# EAGLE design 60W 24V to 12V Flyback (EAGLE 9.6.2)
CHECKED_BY: Matthias Cornelis; MADE_BY: Maxim Yudayev; RELEASE_DATE: Nov 17, 2020; REV: Nov-2020 Rev 0.1; STATUS: Released
Assembly variants: Calculation Method of MI w/ RCD, Calculation Method of MI w/ Clamp

## Sheet 1 of 2: Cover Page
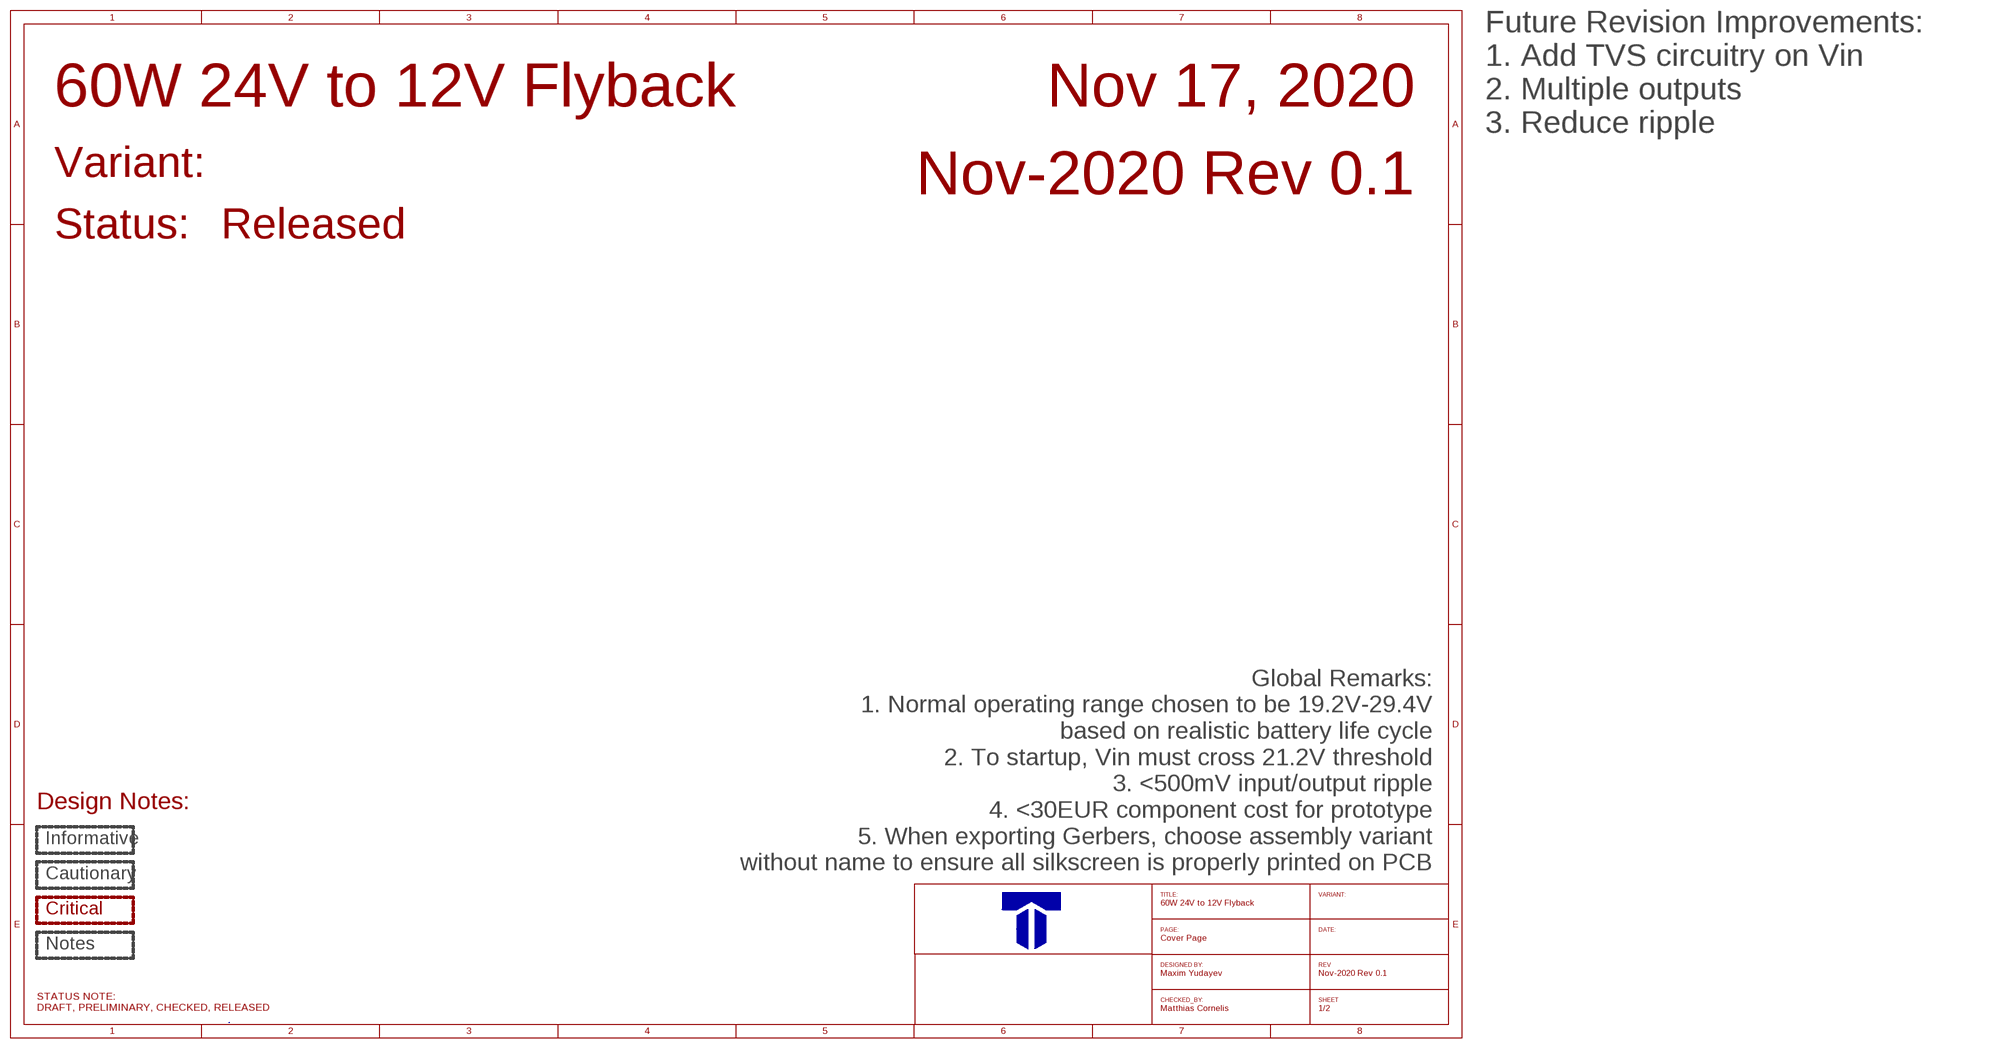
[diagram p0: schematic, sheet 1]

### Notes on the sheet
- Future Revision Improvements:
  1. Add TVS circuitry on Vin
  2. Multiple outputs
  3. Reduce ripple
- Design Notes:
- Informative
- Global Remarks:
  1. Normal operating range chosen to be 19.2V-29.4V
     based on realistic battery life cycle
  2. To startup, Vin must cross 21.2V threshold
  3. <500mV input/output ripple
  4. <30EUR component cost for prototype
  5. When exporting Gerbers, choose assembly variant
     without name to ensure all silkscreen is properly printed on PCB
- Cautionary
- Critical
- Notes

## Sheet 2 of 2: Flyback Converter
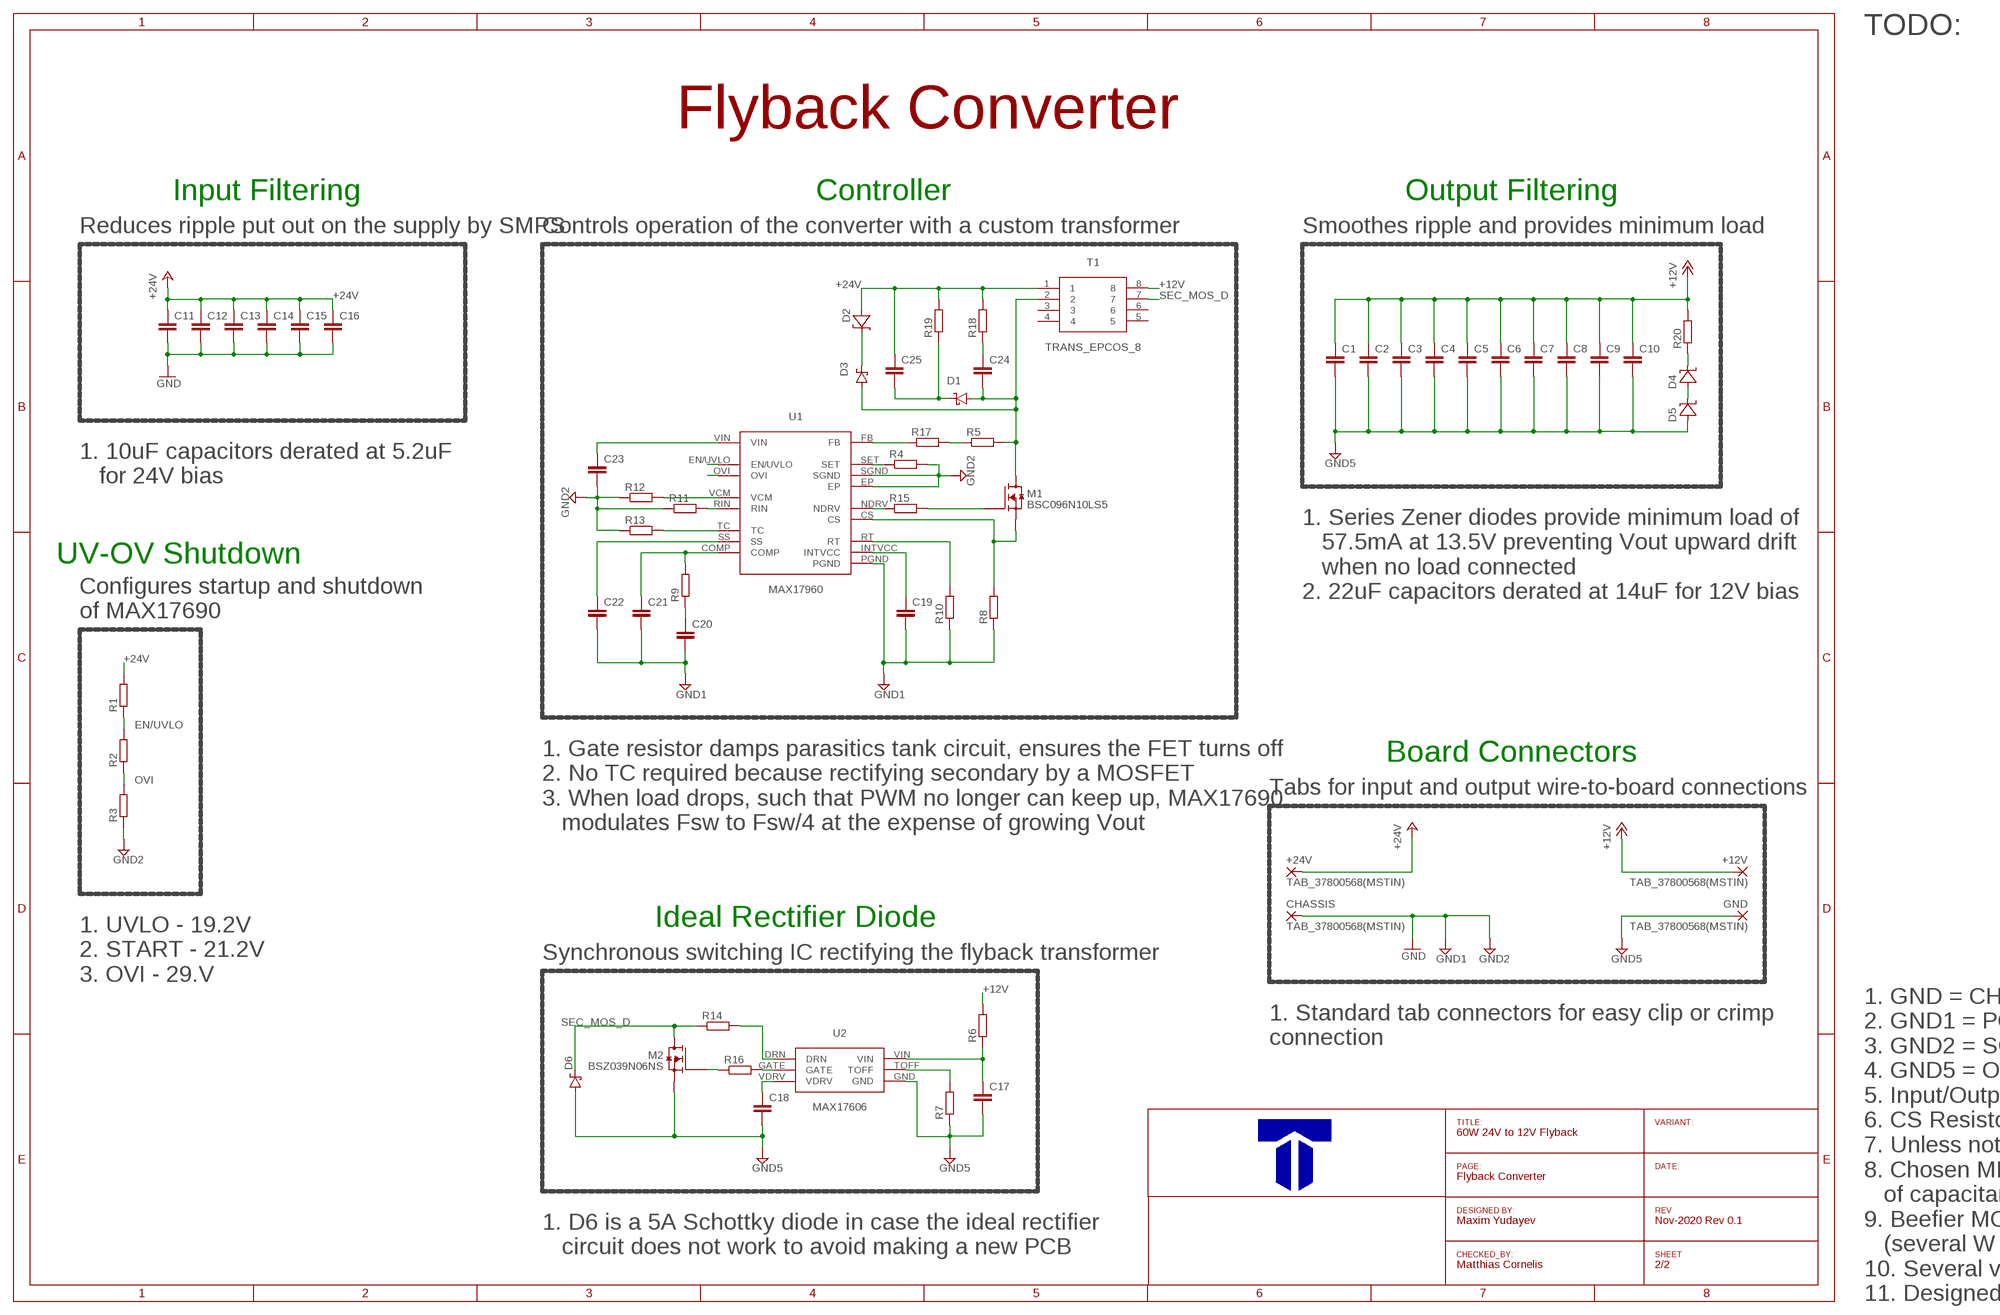
[diagram p1: schematic, sheet 2, part 1 of 2]
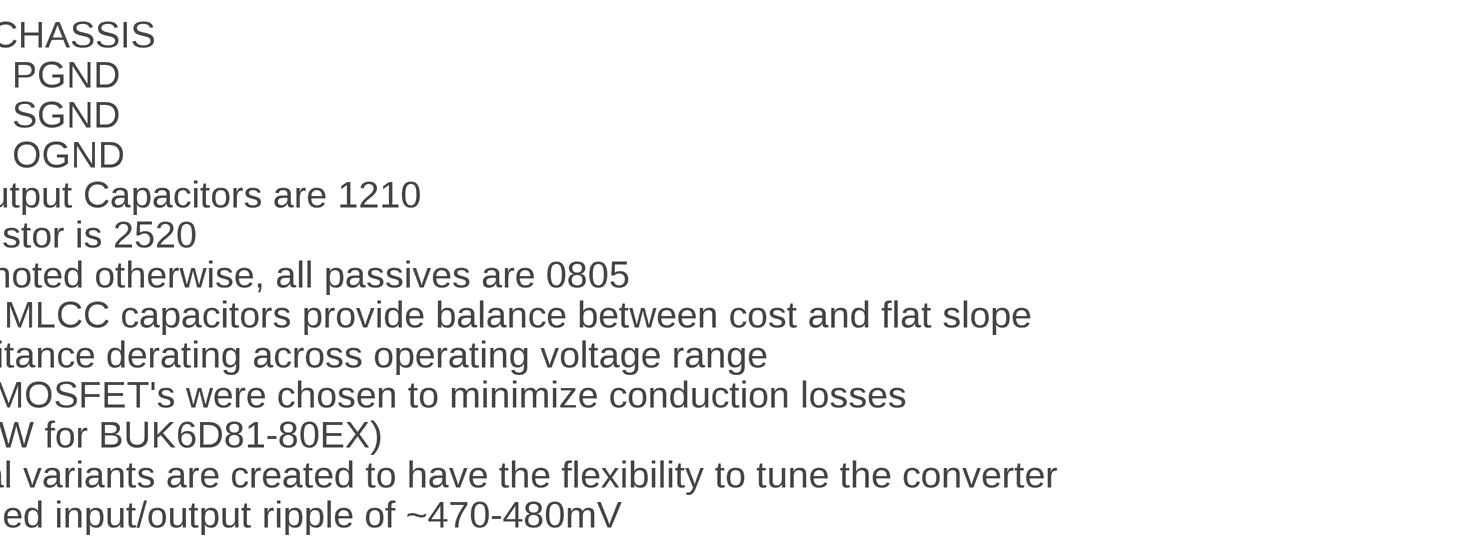
[diagram p2: schematic, sheet 2, part 2 of 2]

### Parts
+12V  TAB_37800568(MSTIN)  [HOLE_1-3]
+24V  TAB_37800568(MSTIN)  [HOLE_1-3]
C1  C-EUC1210K  [C1210K]  (variant Calculation Method of MI w/ RCD: 22u)  (variant Calculation Method of MI w/ Clamp: 22u)
C2  C-EUC1210K  [C1210K]  (variant Calculation Method of MI w/ RCD: 22u)  (variant Calculation Method of MI w/ Clamp: 22u)
C3  C-EUC1210K  [C1210K]  (variant Calculation Method of MI w/ RCD: 22u)  (variant Calculation Method of MI w/ Clamp: 22u)
C4  C-EUC1210K  [C1210K]  (variant Calculation Method of MI w/ RCD: 22u)  (variant Calculation Method of MI w/ Clamp: 22u)
C5  C-EUC1210K  [C1210K]  (variant Calculation Method of MI w/ RCD: 22u)  (variant Calculation Method of MI w/ Clamp: 22u)
C6  C-EUC1210K  [C1210K]  (variant Calculation Method of MI w/ RCD: 22u)  (variant Calculation Method of MI w/ Clamp: 22u)
C7  C-EUC1210K  [C1210K]  (variant Calculation Method of MI w/ RCD: 22u)  (variant Calculation Method of MI w/ Clamp: 22u)
C8  C-EUC1210K  [C1210K]  (variant Calculation Method of MI w/ RCD: 22u)  (variant Calculation Method of MI w/ Clamp: 22u)
C9  C-EUC1210K  [C1210K]  (variant Calculation Method of MI w/ RCD: 22u)  (variant Calculation Method of MI w/ Clamp: 22u)
C10  C-EUC1210K  [C1210K]  (variant Calculation Method of MI w/ RCD: 22u)  (variant Calculation Method of MI w/ Clamp: 22u)
C11  C-EUC1210K  [C1210K]  (variant Calculation Method of MI w/ RCD: 10u)  (variant Calculation Method of MI w/ Clamp: 10u)
C12  C-EUC1210K  [C1210K]  (variant Calculation Method of MI w/ RCD: 10u)  (variant Calculation Method of MI w/ Clamp: 10u)
C13  C-EUC1210K  [C1210K]  (variant Calculation Method of MI w/ RCD: 10u)  (variant Calculation Method of MI w/ Clamp: 10u)
C14  C-EUC1210K  [C1210K]  (variant Calculation Method of MI w/ RCD: 10u)  (variant Calculation Method of MI w/ Clamp: 10u)
C15  C-EUC1210K  [C1210K]  (variant Calculation Method of MI w/ RCD: 10u)  (variant Calculation Method of MI w/ Clamp: 10u)
C16  C-EUC1210K  [C1210K]  (variant Calculation Method of MI w/ RCD: 10u)  (variant Calculation Method of MI w/ Clamp: 10u)
C17  C-EUC0805K  [C0805K]  (variant Calculation Method of MI w/ RCD: 4u7)  (variant Calculation Method of MI w/ Clamp: 4u7)
C18  C-EUC0805K  [C0805K]  (variant Calculation Method of MI w/ RCD: 4u7)  (variant Calculation Method of MI w/ Clamp: 4u7)
C19  C-EUC0805K  [C0805K]  (variant Calculation Method of MI w/ RCD: 4u7)  (variant Calculation Method of MI w/ Clamp: 4u7)
C20  C-EUC0805K  [C0805K]  (variant Calculation Method of MI w/ RCD: 47n)  (variant Calculation Method of MI w/ Clamp: 47n)
C21  C-EUC0805K  [C0805K]  (variant Calculation Method of MI w/ RCD: 560p)  (variant Calculation Method of MI w/ Clamp: 560p)
C22  C-EUC0805K  [C0805K]  (variant Calculation Method of MI w/ RCD: 47n)  (variant Calculation Method of MI w/ Clamp: 47n)
C23  C-EUC0805K  [C0805K]  (variant Calculation Method of MI w/ RCD: 4u7)  (variant Calculation Method of MI w/ Clamp: 4u7)
C24  C-EUC0805K  [C0805K]  (variant Calculation Method of MI w/ RCD: 220p)  (variant Calculation Method of MI w/ Clamp: 220p)
C25  C-EUC0805K  [C0805K]  (not fitted in variant Calculation Method of MI w/ Clamp)  (variant Calculation Method of MI w/ RCD: 150n)
CHASSIS  TAB_37800568(MSTIN)  [HOLE_1-3]
D1  DFLS2100-7  [DFLS2100_DS31475]  (not fitted in variant Calculation Method of MI w/ Clamp)
D2  MMSZ5270BT1G  [MMSZ?T1G_SOD-123_425-04]  (not fitted in variant Calculation Method of MI w/ RCD)
D3  DFLS2100-7  [DFLS2100_DS31475]  (not fitted in variant Calculation Method of MI w/ RCD)
D4  MMSZ4692T1G  [MMSZ?T1G_SOD-123_425-04]
D5  MMSZ4692T1G  [MMSZ?T1G_SOD-123_425-04]
D6  B540C-13-F  [B5?0C-13-F_DO-214AB_DS13012]  (not fitted in variant Calculation Method of MI w/ RCD)  (not fitted in variant Calculation Method of MI w/ Clamp)
GND  TAB_37800568(MSTIN)  [HOLE_1-3]
M1  BSC096N10LS5  [BSC096N10LS5_TDSON-8]
M2  BSZ039N06NS  [BSZ039N06NS_TSDSON-8_Z8B00158553]
R1  R-EU_R0805  [R0805]  (variant Calculation Method of MI w/ RCD: 228k)  (variant Calculation Method of MI w/ Clamp: 228k)
R2  R-EU_R0805  [R0805]  (variant Calculation Method of MI w/ RCD: 3k83)  (variant Calculation Method of MI w/ Clamp: 3k83)
R3  R-EU_R0805  [R0805]  (variant Calculation Method of MI w/ RCD: 10k)  (variant Calculation Method of MI w/ Clamp: 10k)
R4  R-EU_R0805  [R0805]  (variant Calculation Method of MI w/ RCD: 10k)  (variant Calculation Method of MI w/ Clamp: 10k)
R5  R-EU_R0805  [R0805]  (variant Calculation Method of MI w/ RCD: 6k49)  (variant Calculation Method of MI w/ Clamp: 6k49)
R6  R-EU_R0805  [R0805]  (variant Calculation Method of MI w/ RCD: 22)  (variant Calculation Method of MI w/ Clamp: 22)
R7  R-EU_R0805  [R0805]  (variant Calculation Method of MI w/ RCD: 147k)  (variant Calculation Method of MI w/ Clamp: 147k)
R8  R-EU_R2512  [R2512]  (variant Calculation Method of MI w/ RCD: 5m)  (variant Calculation Method of MI w/ Clamp: 5m)
R9  R-EU_R0805  [R0805]  (variant Calculation Method of MI w/ RCD: 3k6)  (variant Calculation Method of MI w/ Clamp: 3k6)
R10  R-EU_R0805  [R0805]  (variant Calculation Method of MI w/ RCD: 33k2)  (variant Calculation Method of MI w/ Clamp: 33k2)
R11  R-EU_R0805  [R0805]  (variant Calculation Method of MI w/ RCD: 137k)  (variant Calculation Method of MI w/ Clamp: 137k)
R12  R-EU_R0805  [R0805]  (variant Calculation Method of MI w/ RCD: 124k)  (variant Calculation Method of MI w/ Clamp: 124k)
R13  R-EU_R0805  [R0805]  (not fitted in variant Calculation Method of MI w/ RCD)  (not fitted in variant Calculation Method of MI w/ Clamp)
R14  R-EU_R0805  [R0805]  (variant Calculation Method of MI w/ RCD: 357)  (variant Calculation Method of MI w/ Clamp: 357)
R15  R-EU_R0805  [R0805]  (variant Calculation Method of MI w/ RCD: 1R2)  (variant Calculation Method of MI w/ Clamp: 1R2)
R16  R-EU_R0805  [R0805]  (variant Calculation Method of MI w/ RCD: 1R2)  (variant Calculation Method of MI w/ Clamp: 1R2)
R17  R-EU_R0805  [R0805]  (variant Calculation Method of MI w/ RCD: 220k)  (variant Calculation Method of MI w/ Clamp: 220k)
R18  R-EU_R0805  [R0805]  (variant Calculation Method of MI w/ RCD: 47)  (variant Calculation Method of MI w/ Clamp: 47)
R19  R-EU_R0805  [R0805]  (not fitted in variant Calculation Method of MI w/ Clamp)  (variant Calculation Method of MI w/ RCD: 10k2)
R20  R-EU_R0805  [R0805]  (variant Calculation Method of MI w/ RCD: 5R1)  (variant Calculation Method of MI w/ Clamp: 5R1)
T1  TRANS_EPCOS_8  [TRANS_EPCOS-B66307_E16/8/5_0.5_3.45UH_200K]
U1  MAX17960  [T1633-4]
U2  MAX17606  [MAX17606_90-0242]

### Nets
+12V: +12V.P$1(P) C1.1 C2.1 C3.1 C4.1 C5.1 C6.1 C7.1 C8.1 C9.1 C10.1 R6.2 R20.2 T1.8
+24V: +24V.P$1(P) C11.1 C12.1 C13.1 C14.1 C15.1 C16.1 C23.1 C25.1 D2.A R1.2 R18.2 R19.2 T1.1 U1.VIN
EN/UVLO: R1.1 R2.2 U1.EN/UVLO
GND: C11.2 C12.2 C13.2 C14.2 C15.2 C16.2 C19.2 C20.2 C21.2 C22.2 C23.2 CHASSIS.P$1(P) R3.1 R4.2 R8.1 R10.1 R11.1 R12.1 R13.1 U1.EP U1.PGND U1.SGND ; supply symbol labelled GND1, GND2
GND5: C1.2 C2.2 C3.2 C4.2 C5.2 C6.2 C7.2 C8.2 C9.2 C10.2 C17.2 C18.2 D5.A D6.A GND.P$1(P) M2.S R7.1 U2.GND
N$1: R4.1 U1.SET
N$2: C18.1 U2.VDRV
N$3: R17.1 U1.FB
N$4: C24.1 R18.1
N$5: C17.1 R6.1 U2.VIN
N$6: R7.2 U2.TOFF
N$7: R14.2 U2.DRN
N$8: C19.1 U1.INTVCC
N$9: C25.2 D1.C(K) R19.1
N$10: C20.1 R9.1
N$11: C21.1 R9.2 U1.COMP
N$12: R10.2 U1.RT
N$13: C22.1 U1.SS
N$14: R12.2 U1.VCM
N$15: R11.2 U1.RIN
N$16: R13.2 U1.TC
N$17: R15.1 U1.NDRV
N$18: R16.2 U2.GATE
N$19: R5.1 R17.2
N$20: D2.C D3.C(K)
N$21: D4.C R20.1
N$22: D4.A D5.C
OVI: R2.1 R3.2 U1.OVI
PRI_MOS_D: C24.2 D1.A D3.A M1.D R5.2 T1.2
PRI_MOS_G: M1.G R15.2
PRI_MOS_S: M1.S R8.2 U1.CS
SEC_MOS_D: D6.C(K) M2.D R14.1 T1.7
SEC_MOS_G: M2.G R16.1
Unconnected: T1.3 T1.4 T1.5 T1.6

### Notes on the sheet
- TODO:
- Input Filtering | Controller | Output Filtering
- Reduces ripple put out on the supply by SMPS | Controls operation of the converter with a custom transformer | Smoothes ripple and provides minimum load
- 1. 10uF capacitors derated at 5.2uF 
     for 24V bias
- 1. Series Zener diodes provide minimum load of
     57.5mA at 13.5V preventing Vout upward drift
     when no load connected
  2. 22uF capacitors derated at 14uF for 12V bias
- UV-OV Shutdown
- Configures startup and shutdown
  of MAX17690
- 1. Gate resistor damps parasitics tank circuit, ensures the FET turns off
  2. No TC required because rectifying secondary by a MOSFET
  3. When load drops, such that PWM no longer can keep up, MAX17690
     modulates Fsw to Fsw/4 at the expense of growing Vout
- Board Connectors
- Tabs for input and output wire-to-board connections
- 1. UVLO - 19.2V
  2. START - 21.2V
  3. OVI - 29.V
- Ideal Rectifier Diode
- Synchronous switching IC rectifying the flyback transformer
- 1. Standard tab connectors for easy clip or crimp
  connection
- 1. D6 is a 5A Schottky diode in case the ideal rectifier
     circuit does not work to avoid making a new PCB
- 1. GND = CHASSIS
  2. GND1 = PGND
  3. GND2 = SGND
  4. GND5 = OGND
  5. Input/Output Capacitors are 1210
  6. CS Resistor is 2520
  7. Unless noted otherwise, all passives are 0805
  8. Chosen MLCC capacitors provide balance between cost and flat slope
     of capacitance derating across operating voltage range
  9. Beefier MOSFET's were chosen to minimize conduction losses
     (several W for BUK6D81-80EX)
  10. Several variants are created to have the flexibility to tune the converter
  11. Designed input/output ripple of ~470-480mV

## Library data of the parts
+12V +24V CHASSIS GND = Maxim's KU Leuven:TAB_37800568(MSTIN)
C1-C16 = Maxim's KU Leuven:C-EU: CAPACITOR, European symbol
C17-C25 = Maxim's KU Leuven:C-EU: CAPACITOR, European symbol; SPICEPREFIX: C
D1 D3 = Maxim's KU Leuven:DFLS2100*
D2 = Maxim's KU Leuven:MMSZ52?T1G
D4 D5 = Maxim's KU Leuven:MMSZ4?T1G
D6 = Maxim's KU Leuven:B5?0C-13-F
M1 = Maxim's KU Leuven:BSC096N10LS5
M2 = Maxim's KU Leuven:BSZ039N06NS
R1-R7 R9-R20 = Maxim's KU Leuven:R-EU_: RESISTOR, European symbol; SPICEPREFIX: R
R8 = Maxim's KU Leuven:R-EU_: RESISTOR, European symbol
T1 = Maxim's KU Leuven:TRANS_EPCOS_8
U1 = Maxim's KU Leuven:MAX17960*
U2 = Maxim's KU Leuven:MAX17606

## Board
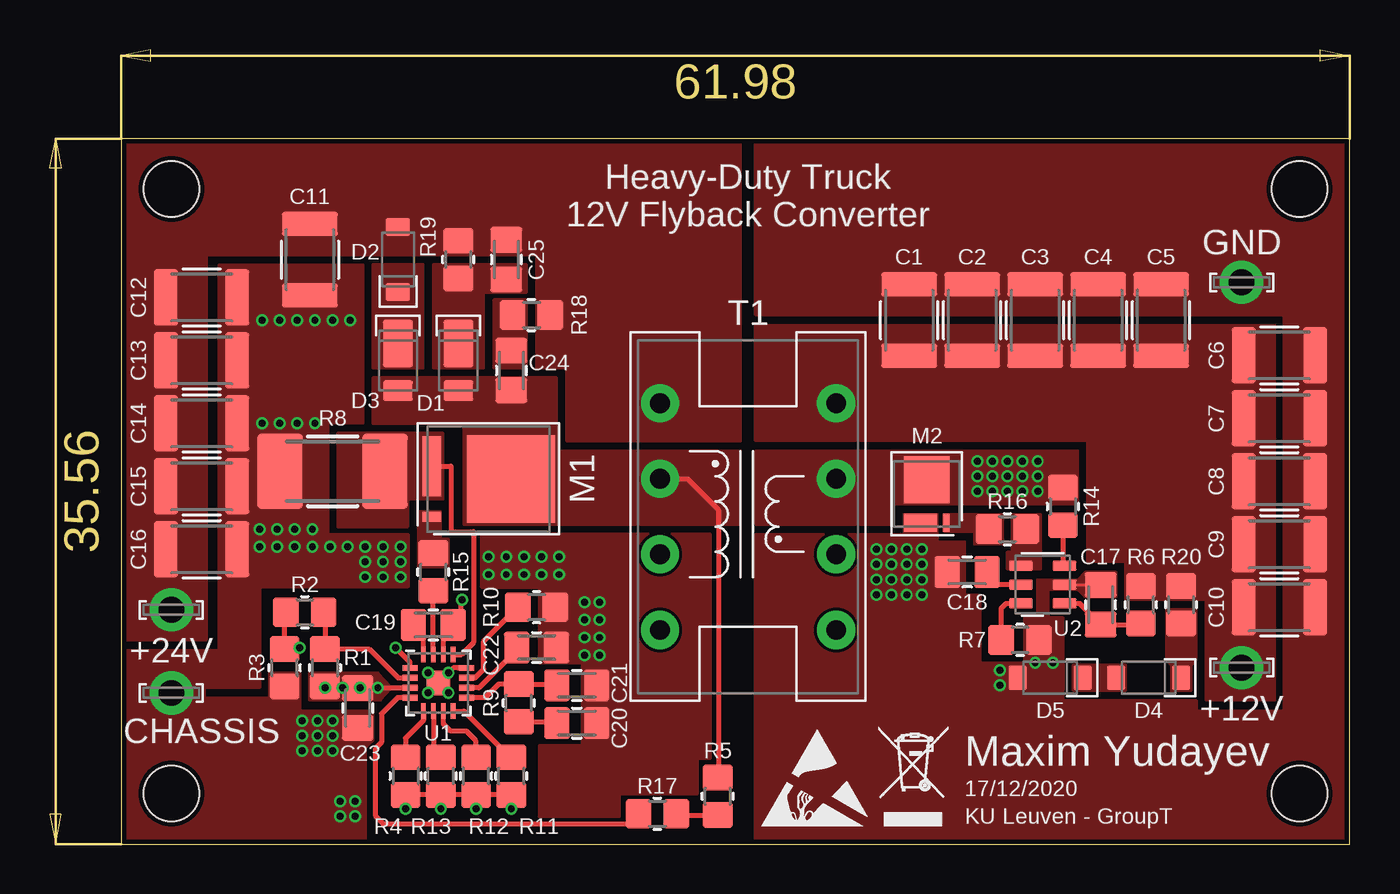
[diagram p3: board, top side]
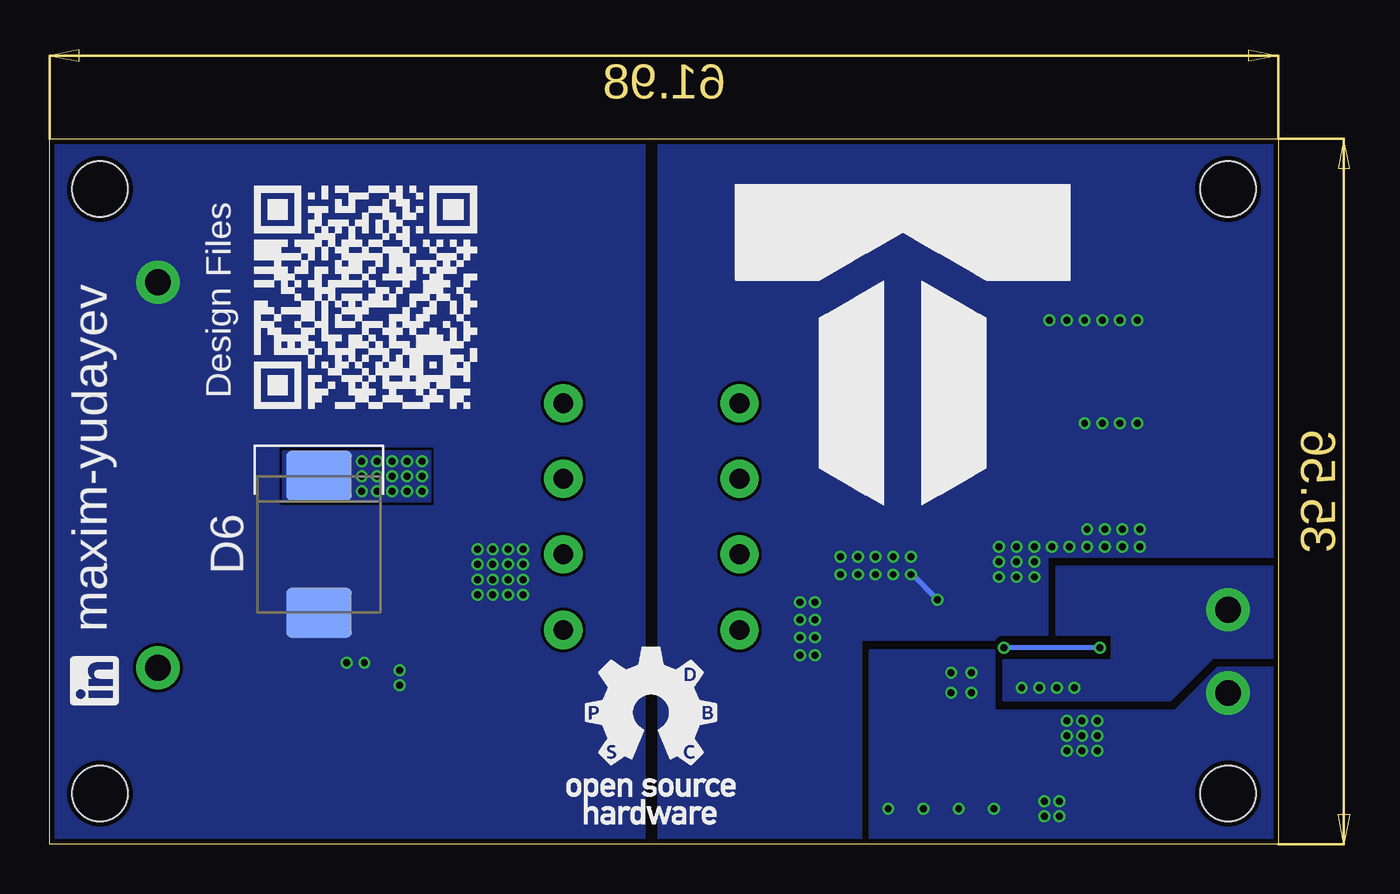
[diagram p4: board, bottom side, seen from below]

Size 61.98 x 35.56 mm. Coordinates in mm from the lower left corner, seen from the top.
Outline: 0,0 61.98,0 61.98,35.56 0,35.56 0,0
Copper layers (1*16): Top 0.018mm / dielectric 1.55mm / Bottom 0.018mm
Design rules "eC_2Layer_PClass6_BaseCopperO18_eCDefault": minimum track width 0.15mm, minimum drill 0.35mm, track to track 0.15mm, track to pad 0.15mm, pad to pad 0.15mm, via to via 0.15mm, smd to smd 0mil, copper to edge 0.25mm, drill to drill 0.35mm, minimum pad ring 0.175mm, minimum via ring 0.125mm, stop-mask expansion 0mil, vias tented up to drill 0.45mm, thermal gap 0.2mm
Holes 2.8 mm at 59.44,33.02 59.44,2.54 2.54,33.02 2.54,2.54
tRestrict: 8 lines

### Footprints (pad centres in the part's own frame; a part is rotated, then mirrored left to right if it is on the bottom)
HOLE_1-3 = drill 1.3 pad 2.184: P$1 0,0
C1210K = smd 1.2 x 2.8: 1 -1.8,0; 2 1.8,0
C0805K = smd 1.3 x 1.6: 1 -1,0; 2 1,0
DFLS2100_DS31475 = smd 1.05 x 1.5: A -1.525,0 | smd 2.4 x 1.5: C 0.85,0
MMSZ?T1G_SOD-123_425-04 = smd 0.91 x 1.22: A -1.635,0; C 1.635,0
B5?0C-13-F_DO-214AB_DS13012 = smd 2.5 x 3.3: A -3.45,0; C 3.45,0
BSC096N10LS5_TDSON-8 = smd 4.41 x 4.455: D 0,1.13 | smd 0.5 x 0.925: G 1.905,-2.865 | smd 3.04 x 0.925: S -0.635,-2.865
BSZ039N06NS_TSDSON-8_Z8B00158553 = smd 2.29 x 2.36: D 0,0.72 | smd 0.34 x 0.9: G 0.975,-1.45 | smd 1.64 x 0.9: S -0.325,-1.45
R0805 = smd 1.3 x 1.5: 1 -0.95,0; 2 0.95,0
R2512 = smd 2.3 x 3.8: 1 -2.65,0; 2 2.65,0
TRANS_EPCOS-B66307_E16/8/5_0.5_3.45UH_200K = drill 1 pad 1.93: 1 -4.445,5.715; 2 -4.445,1.905; 3 -4.445,-1.905; 4 -4.445,-5.715; 5 4.445,-5.715; 6 4.445,-1.905; 7 4.445,1.905; 8 4.445,5.715
T1633-4 = smd 0.8 x 0.3: COMP 1.425,-0.75; EN/UVLO -1.425,0.25; FB -1.425,-0.75; OVI -1.425,0.75; RT 1.425,0.25; SGND 1.425,0.75; SS 1.425,-0.25; VIN -1.425,-0.25 | smd 0.3 x 0.8: CS 0.75,1.425; INTVCC -0.75,1.425; NDRV -0.25,1.425; PGND 0.25,1.425; RIN 0.75,-1.425; SET -0.75,-1.425; TC -0.25,-1.425; VCM 0.25,-1.425 | smd 1.23 x 1.23: EP 0,0
MAX17606_90-0242 = smd 1.2 x 0.5: DRN -1.1,-0.95; GATE 1.1,-0.95; GND -1.1,0; TOFF 1.1,0.95; VDRV 1.1,0; VIN -1.1,0.95

### Placement (x,y rotation side)
+12V  56.52,8.89 90 top
+24V  2.54,11.81 270 top
C1  22u  [C1210K]  39.75,26.42 90 top
C2  22u  [C1210K]  42.93,26.42 90 top
C3  22u  [C1210K]  46.1,26.42 90 top
C4  22u  [C1210K]  49.28,26.42 90 top
C5  22u  [C1210K]  52.45,26.42 90 top
C6  22u  [C1210K]  58.42,24.64 0 top
C7  22u  [C1210K]  58.42,21.46 0 top
C8  22u  [C1210K]  58.42,18.29 0 top
C9  22u  [C1210K]  58.42,15.11 0 top
C10  22u  [C1210K]  58.42,11.94 0 top
C11  10u  [C1210K]  9.53,29.46 270 top
C12  10u  [C1210K]  4.06,27.56 0 top
C13  10u  [C1210K]  4.06,24.38 0 top
C14  10u  [C1210K]  4.06,21.21 0 top
C15  10u  [C1210K]  4.06,18.03 0 top
C16  10u  [C1210K]  4.06,14.86 0 top
C17  4u7  [C0805K]  49.4,12.06 90 top
C18  4u7  [C0805K]  42.67,13.72 180 top
C19  4u7  [C0805K]  15.75,11.05 0 top
C20  47n  [C0805K]  22.99,6.1 0 top
C21  560p  [C0805K]  22.99,8 0 top
C22  47n  [C0805K]  20.95,9.91 0 top
C23  4u7  [C0805K]  11.94,6.86 270 top
C24  220p  [C0805K]  19.68,23.88 270 top
C25  150n  [C0805K]  19.43,29.46 270 top  (not fitted)
CHASSIS  2.54,7.62 270 top
D1  17.02,24.38 90 top  (not fitted)
D2  13.97,29.46 270 top
D3  13.97,24.38 90 top
D4  51.82,8.38 0 top
D5  46.86,8.38 0 top
D6  48.39,15.11 90 bottom  (not fitted)
GND  56.52,28.32 90 top
M1  18.54,18.41 270 top
M2  40.64,17.65 0 top
R1  228k  [R0805]  10.29,8.89 270 top
R2  3k83  [R0805]  9.27,11.68 0 top
R3  10k  [R0805]  8.26,8.89 90 top
R4  10k  [R0805]  14.35,3.43 270 top
R5  6k49  [R0805]  30.1,2.41 90 top
R6  22  [R0805]  51.44,12.06 90 top
R7  147k  [R0805]  45.34,10.29 180 top
R8  5m  [R2512]  10.67,18.8 0 top
R9  3k6  [R0805]  20.07,7.11 90 top
R10  33k2  [R0805]  20.95,11.94 180 top
R11  137k  [R0805]  19.68,3.43 90 top
R12  124k  [R0805]  17.91,3.43 90 top
R13  16.13,3.43 90 top  (not fitted)
R14  357  [R0805]  47.5,17.02 270 top
R15  1R2  [R0805]  15.75,13.72 90 top
R16  1R2  [R0805]  44.7,15.88 0 top
R17  220k  [R0805]  27.05,1.52 0 top
R18  47  [R0805]  20.7,26.67 0 top
R19  10k2  [R0805]  17.02,29.46 90 top  (not fitted)
R20  5R1  [R0805]  53.47,12.06 90 top
T1  31.62,16.51 0 top
U1  16,8.13 0 top
U2  46.48,13.08 180 top

### Tracks (layer width: path | path; a pad name or v marks a point on that pad's centre or on a via)
+12V
  pour Top (no thermals): 32,20.32 32,26.16 58.17,26.16 58.17,7.24 54.74,7.24 54.74,12.32 50.67,12.32 50.67,14.22 48.77,14.22 48.77,20.32
+24V  (via drill 0.35)
  Top 0.254: C23.1 11.96,7.88 U1.VIN
  other vias: 10.29,7.87 11.18,7.87 12.06,7.87 12.95,7.87
  pour Top (no thermals): 0,35.56 0,10.29 4.32,10.29 4.32,29.72 20.95,29.72 20.95,24 22.48,24 22.48,20.32 31.24,20.32 31.24,35.56
  pour Top (no thermals): 9.53,7.24 9.53,8.64 12.94,8.64 13.58,7.95 14.9,7.95 14.9,7.8 13.58,7.8 13.07,7.24
  pour Bottom (no thermals): 11.18,10.54 11.18,13.97 0,13.97 0,9.4 3.3,9.4 5.46,7.24 13.84,7.24 13.84,9.27 8.38,9.27 8.38,10.54
EN/UVLO
  Top 0.254: R2.2 10.29,11.62 R1.1 12.51,9.84 13.97,8.38 U1.EN/UVLO
GND  (via drill 0.35)
  Top 0.254: U1.SGND 17,8.88 16.75,8.88 v16.51,8.64 U1.EP | U1.EP v15.49,7.62 | U1.EP v15.49,8.64 | U1.EP v16.51,7.62 | R12.1 R11.1 v19.68,1.78 | R12.1 R13.1 | R13.1 R4.2 v14.35,1.78 | v17.2,12.32 17.13,12.24 17.13,11.43 C19.2 16.25,10.55 U1.PGND | R13.1 v16.13,1.78 | R12.1 v17.91,1.78
  Bottom 0.254: v18.54,13.59 18.47,13.59 v17.2,12.32
  other vias: 23.37,12.19 24.13,12.19 23.37,11.3 24.13,10.41 24.13,11.3 23.37,10.41 23.37,9.53 24.13,9.53 19.43,13.59 19.43,14.48 20.32,13.59 21.21,14.48 20.32,14.48 21.21,13.59 22.1,13.59 22.1,14.48 9.14,4.7 10.67,5.46 9.91,6.22 9.14,6.22 10.67,4.7 10.67,6.22 9.91,4.7 9.91,5.46 9.14,5.46 6.99,14.99 7.87,14.99 10.54,14.99 7.87,15.88 11.43,14.99 6.99,15.88 7.11,21.21 8,21.21 8.76,14.99 9.65,14.99 12.32,14.99 9.65,15.88 13.21,14.99 8.76,15.88 8.89,21.21 9.78,21.21 18.54,14.48 7.11,26.42 8,26.42 8.89,26.42 9.78,26.42 10.67,26.42 11.56,26.42 14.1,14.99 12.32,14.22 13.21,14.22 14.1,14.22 12.32,13.46 13.21,13.46 14.1,13.46 11.81,2.16 11.81,1.4 11.05,1.4 11.05,2.16
  pour Top (no thermals): 6.99,7.87 4.19,7.87 4.19,6.99 0,6.99 0,9.78 4.95,9.78 4.95,29.21 12.19,29.21 12.19,21.21 10.41,21.21 10.41,15.62 14.48,15.62 14.48,12.95 6.99,12.95
  pour Bottom (no thermals): 11.68,14.48 11.68,10.54 14.1,10.54 14.35,10.29 21.08,10.29 21.08,0 31.24,0 31.24,35.56 0,35.56 0,14.48
  pour Top (no thermals): 21.08,9.14 23.24,9.14 23.24,4.95 21.08,4.95 21.08,1.4 25.15,1.4 25.15,2.54 29.08,2.54 29.08,4.32 29.72,4.32 29.72,15.62 18.16,15.62 18.16,12.95 21.08,12.95
  pour Top (no thermals): 0,7.37 7.49,7.37 7.49,8.64 9.02,8.64 9.02,6.73 12.7,6.73 12.7,5.21 12.32,4.83 12.32,0 0,0
  pour Bottom (no thermals): 20.57,0 20.57,9.78 14.35,9.78 14.35,6.73 5.21,6.73 3.05,8.89 0,8.89 0,0
GND5  (via drill 0.35)
  Top 0.152: U2.GND 49.39,13.08 C17.2
  other vias: 38.1,14.86 38.1,14.1 38.1,13.34 38.86,13.34 38.86,14.1 38.86,14.86 39.62,14.86 39.62,14.1 39.62,13.34 44.32,8.76 44.32,8 46.1,9.14 46.99,9.14 40.39,14.86 40.39,13.34 40.39,14.1 38.1,12.57 38.86,12.57 39.62,12.57 40.39,12.57
  pour Top (no thermals): 39.5,16.64 41.15,16.64 41.15,15.24 42.55,15.24 42.55,12.57 43.31,12.57 43.31,9.14 45.59,9.14 45.59,11.43 46.23,11.43 46.23,13.34 48.26,13.34 48.64,13.72 50.16,13.72 50.16,12.45 48.64,12.45 48.26,12.83 46.74,12.83 46.74,11.43 47.5,11.43 47.5,7.24 54.23,7.24 54.23,6.73 58.67,6.73 58.67,26.67 32,26.67 32,35.56 61.98,35.56 61.98,0 32,0 32,15.62 39.5,15.62
  pour Bottom (rank 2, no thermals): 32,35.56 32,0 61.98,0 61.98,35.56
N$1
  Top 0.254: U1.SET 15.25,6.24 14.35,5.33 R4.1
N$2
  Top 0.254: U2.VDRV 44.18,13.08 43.67,13.59 C18.1
N$3
  Top 0.254: U1.FB 13.94,7.38 13.14,6.58 13.14,5.12 12.82,4.79 12.82,1.43 13.23,1.02 25.59,1.02 R17.1
N$4
  pour Top (no thermals): 18.8,27.43 18.8,24 20.45,24 20.45,27.43
N$5
  Top 0.152: 51.38,11.06 R6.1
  Top 0.254: U2.VIN 48.34,12.13 C17.1 51.38,11.06
N$6
  Top 0.254: R7.2 44.39,11.88 44.64,12.13 U2.TOFF
N$7
  Top 0.254: R14.2 47.5,14.12 U2.DRN
N$8
  Top 0.254: U1.INTVCC 15.25,10.54 C19.1
N$9
  pour Top (no thermals): 15.75,24 18.29,24 18.29,27.81 20.45,27.81 20.45,29.21 15.75,29.21
N$10
  Top 0.254: R9.1 21.92,6.16 C20.1
N$11
  Top 0.254: U1.COMP 18.37,7.38 19.05,8.06 R9.2 21.93,8.06 C21.1
N$12
  Top 0.254: U1.RT 17.85,8.38 18.29,8.81 18.29,10.22 R10.2
N$13
  Top 0.254: U1.SS 18.05,7.88 19.95,9.78 C22.1
N$14
  Top 0.254: R12.2 17.91,5.21 17.43,5.69 16.63,5.69 16.25,6.07 U1.VCM
N$15
  Top 0.254: U1.RIN 17.3,6.7 19.62,4.38 R11.2
N$16
  Top 0.254: R13.2 15.75,4.76 U1.TC
N$17
  Top 0.254: U1.NDRV R15.1
N$18
  pour Top (no thermals): 44.7,13.84 44.7,14.73 44.96,14.73 44.96,16.64 46.35,16.64 46.35,13.84
N$19
  Top 0.254: R17.2 28.06,1.46 R5.1
N$20
  pour Top (no thermals): 12.7,24 15.24,24 15.24,29.21 12.7,29.21
N$21
  pour Top (no thermals): 52.7,11.81 52.7,9.27 52.96,9.02 52.96,7.75 53.98,7.75 53.98,9.02 54.23,9.27 54.23,11.81
N$22
  pour Top (no thermals): 48.01,9.02 48.01,7.75 50.67,7.75 50.67,9.02
OVI  (via drill 0.35)
  Top 0.254: R2.1 8.26,11.62 R3.2 8.32,9.91 v9.02,9.91 | U1.OVI 14.58,9.17 v13.84,9.91
  Bottom 0.254: v9.02,9.91 v13.84,9.91
PRI_MOS_D
  Top 0.254: R5.2 30.13,3.39 30.13,16.86 28.57,18.41 T1.2
  pour Top (no thermals): 12.7,23.5 12.7,21.21 17.27,21.21 17.27,16.13 31.24,16.13 31.24,19.81 21.97,19.81 21.97,23.5
PRI_MOS_G
  pour Top (no thermals): 16.13,16.76 14.99,16.76 14.99,13.97 16.51,13.97 16.51,15.37 16.13,15.37
PRI_MOS_S
  Top 0.254: M1.S 16.64,19.05 16.64,15.75 17.78,15.75 17.78,10.16 17.17,9.55 U1.CS
  pour Top (no thermals): 10.92,20.7 10.92,16 14.48,16 14.48,17.4 16.26,17.4 16.26,20.7
SEC_MOS_D  (via drill 0.35)
  other vias: 43.18,19.3 43.18,18.54 43.18,17.78 43.94,19.3 43.94,18.54 43.94,17.78 44.7,19.3 44.7,18.54 44.7,17.78 45.47,19.3 45.47,18.54 45.47,17.78 46.23,19.3 46.23,18.54 46.23,17.78
  pour Top (no thermals): 32,19.81 32,16.13 38.99,16.13 38.99,17.14 48.26,17.14 48.26,19.81
  pour Bottom (isolate 0.254, no thermals): 50.16,19.81 42.8,19.81 42.8,17.27 50.16,17.27
SEC_MOS_G
  pour Top (no thermals): 41.53,16.64 44.45,16.64 44.45,15.11 43.05,15.11 43.05,15.75 41.53,15.75

### Text on the board
bPlace: Design Files | maxim-yudayev
tNames: Heavy-Duty Truck / 12V Flyback Converter | Maxim Yudayev | 17/12/2020 | KU Leuven - GroupT